# EAGLE schematic seamonster_schematic (EAGLE 8.5.2)

## Sheet 1 of 5: Power Filtering & Bypass
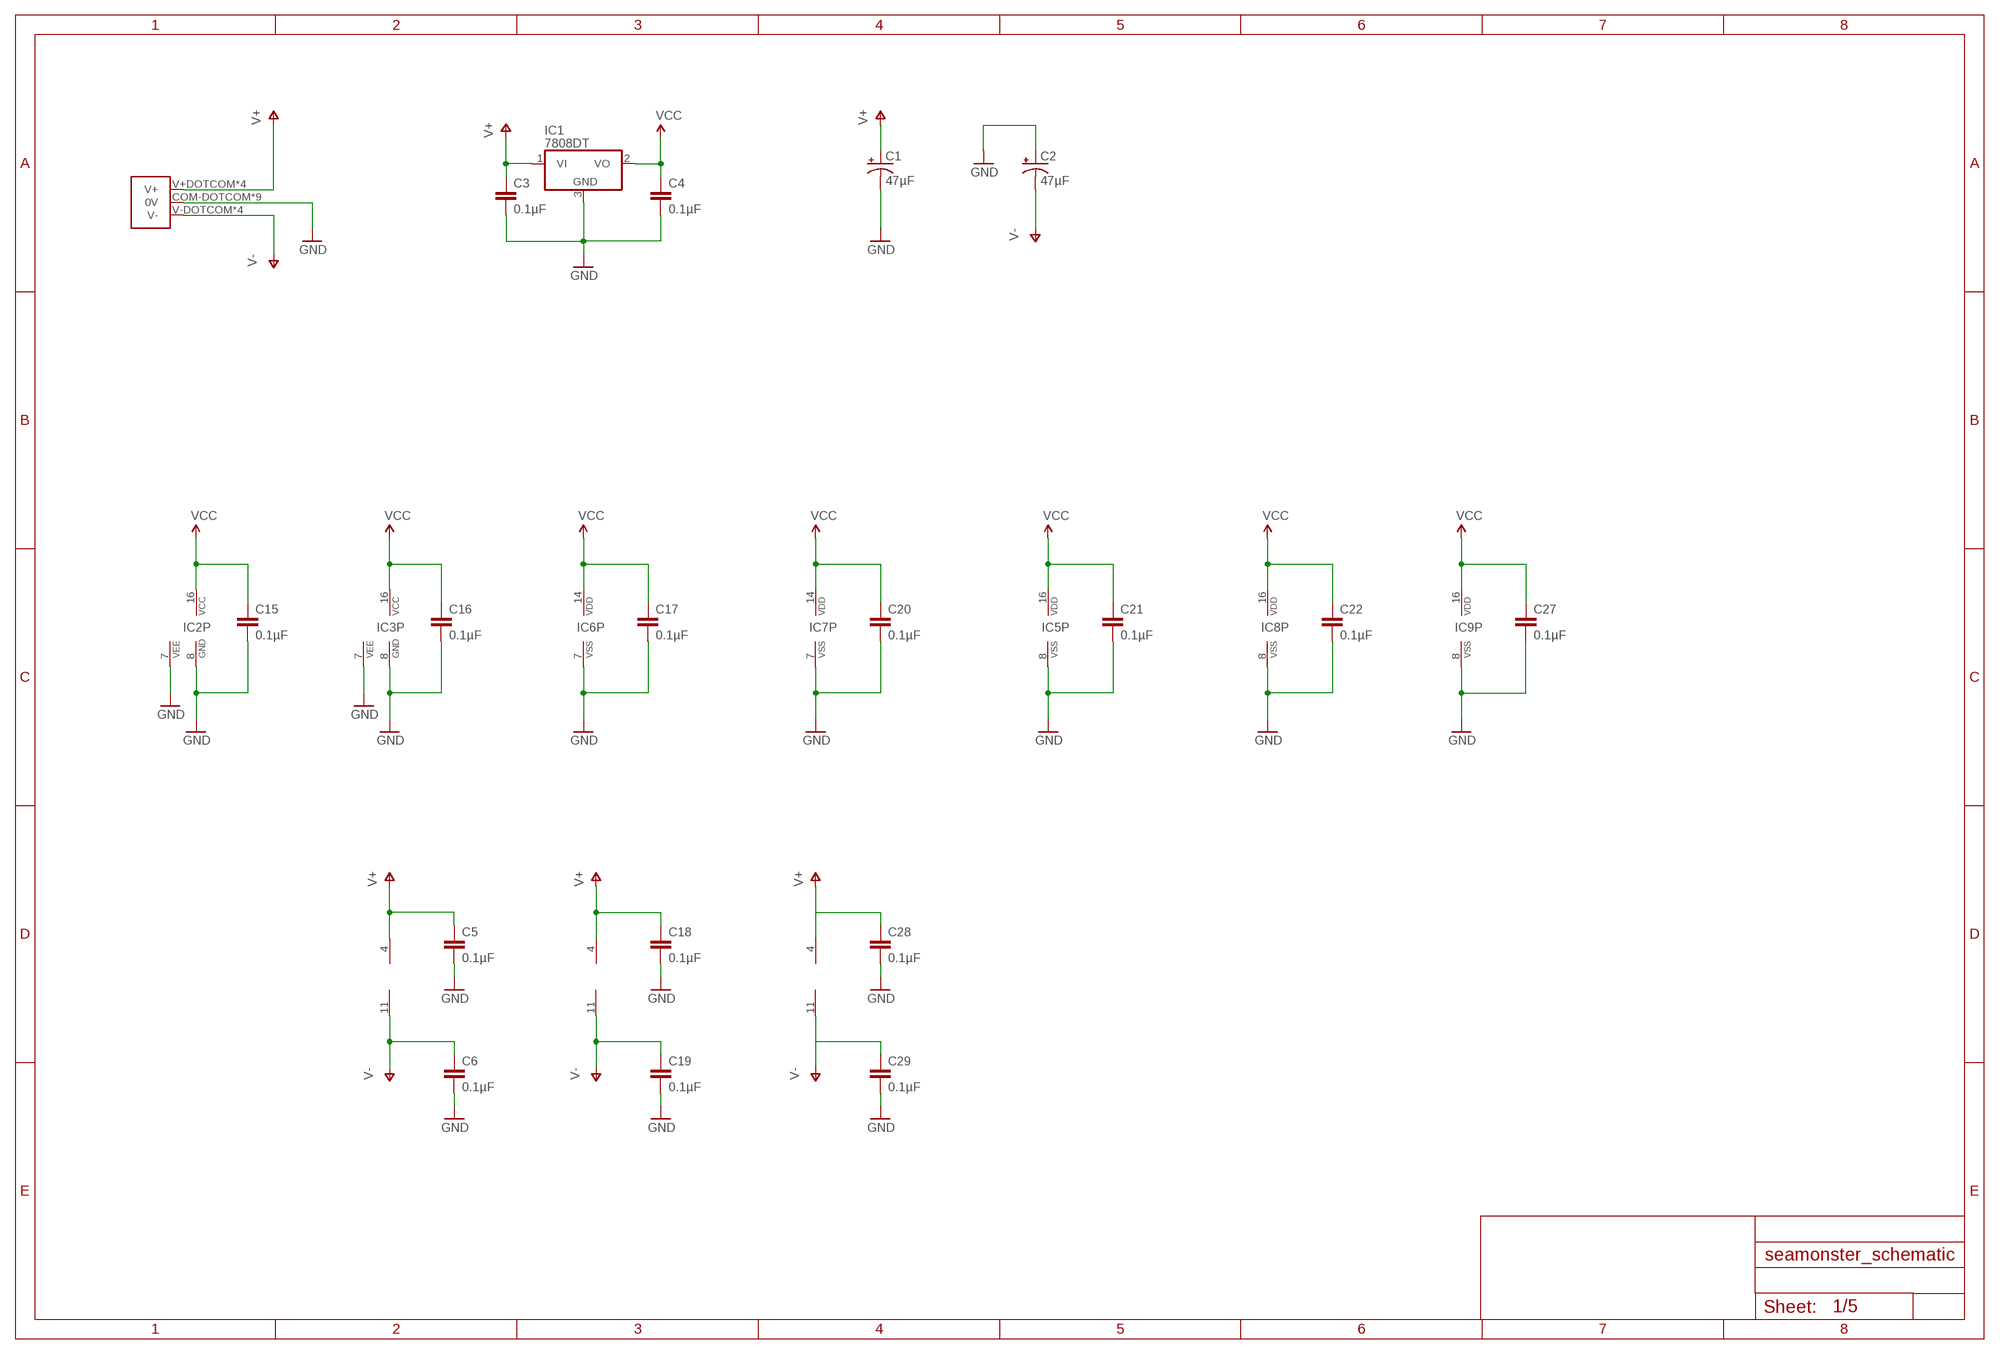
[diagram p0: schematic, sheet 1]

### Parts
C1  47µF  CAP_POLPTH2  [CPOL-RADIAL-10UF-25V]
C2  47µF  CAP_POLPTH2  [CPOL-RADIAL-10UF-25V]
C3  0.1µF  CAP0805  [0805]
C4  0.1µF  CAP0805  [0805]
C5  0.1µF  CAP0805  [0805]
C6  0.1µF  CAP0805  [0805]
C15  0.1µF  CAP0805  [0805]
C16  0.1µF  CAP0805  [0805]
C17  0.1µF  CAP0805  [0805]
C18  0.1µF  CAP0805  [0805]
C19  0.1µF  CAP0805  [0805]
C20  0.1µF  CAP0805  [0805]
C21  0.1µF  CAP0805  [0805]
C22  0.1µF  CAP0805  [0805]
C27  0.1µF  CAP0805  [0805]
C28  0.1µF  CAP0805  [0805]
C29  0.1µF  CAP0805  [0805]
IC1  7808DT  [TO252]
IC2  4051D  [SO16]
IC3  4051D  [SO16]
IC5  4046D  [SO16]
IC6  40106D  [SO14]
IC7  4070D  [SO14]
IC8  4046D  [SO16]
IC9  4040D  [SO16]
U1  TL084  TL074_SMD  [SO14]
U2  TL084  TL074_SMD  [SO14]
U3  TL084  TL074_SMD  [SO14]
U$1  COMBO_POWER  [COMBO_POWER]

### Nets
GND: C1.2(-) C2.1(+) C3.2 C4.2 C5.2 C6.2 C15.2 C16.2 C17.2 C18.2 C19.2 C20.2 C21.2 C22.2 C27.2 C28.2 C29.2 IC1.3(GND) IC2.7(VEE) IC2.8(GND) IC3.7(VEE) IC3.8(GND) IC5.8(VSS) IC6.7(P:VSS) IC7.7(P:VSS) IC8.8(VSS) IC9.8(VSS) U$1.COM-DOTCOM(0V) U$1.COM-EURO1(0V) U$1.COM-EURO2(0V) U$1.COM-EURO3(0V) U$1.COM-EURO4(0V) U$1.COM-EURO5(0V) U$1.COM-EURO6(0V) U$1.COM-MOTM1(0V) U$1.COM_MOTM2(0V) ; also sheet 2,3,4,5
V+: C1.1(+) C3.1 C5.1 C18.1 C28.1 IC1.1(VI) U1.4(P:V+) U2.4(P:V+) U3.4(P:V+) U$1.V+DOTCOM(V+) U$1.V+EURO1(V+) U$1.V+EURO2(V+) U$1.V+MOTM(V+) ; also sheet 3
V-: C2.2(-) C6.1 C19.1 C29.1 U1.11(P:V-) U2.11(P:V-) U3.11(P:V-) U$1.V-DOTCOM(V-) U$1.V-EURO1(V-) U$1.V-EURO2(V-) U$1.V-MOTM(V-) ; also sheet 3
VCC: C4.1 C15.1 C16.1 C17.1 C20.1 C21.1 C22.1 C27.1 IC1.2(VO) IC2.16(VCC) IC3.16(VCC) IC5.16(VDD) IC6.14(P:VDD) IC7.14(P:VDD) IC8.16(VDD) IC9.16(VDD) ; also sheet 3
Unconnected: IC6.12(F:O) IC6.13(F:I) U3.8(C:OUT) U3.9(C:-IN) U3.10(C:+IN) U3.12(D:+IN) U3.13(D:-IN) U3.14(D:OUT)

## Sheet 2 of 5: Clock Oscillator & Divider
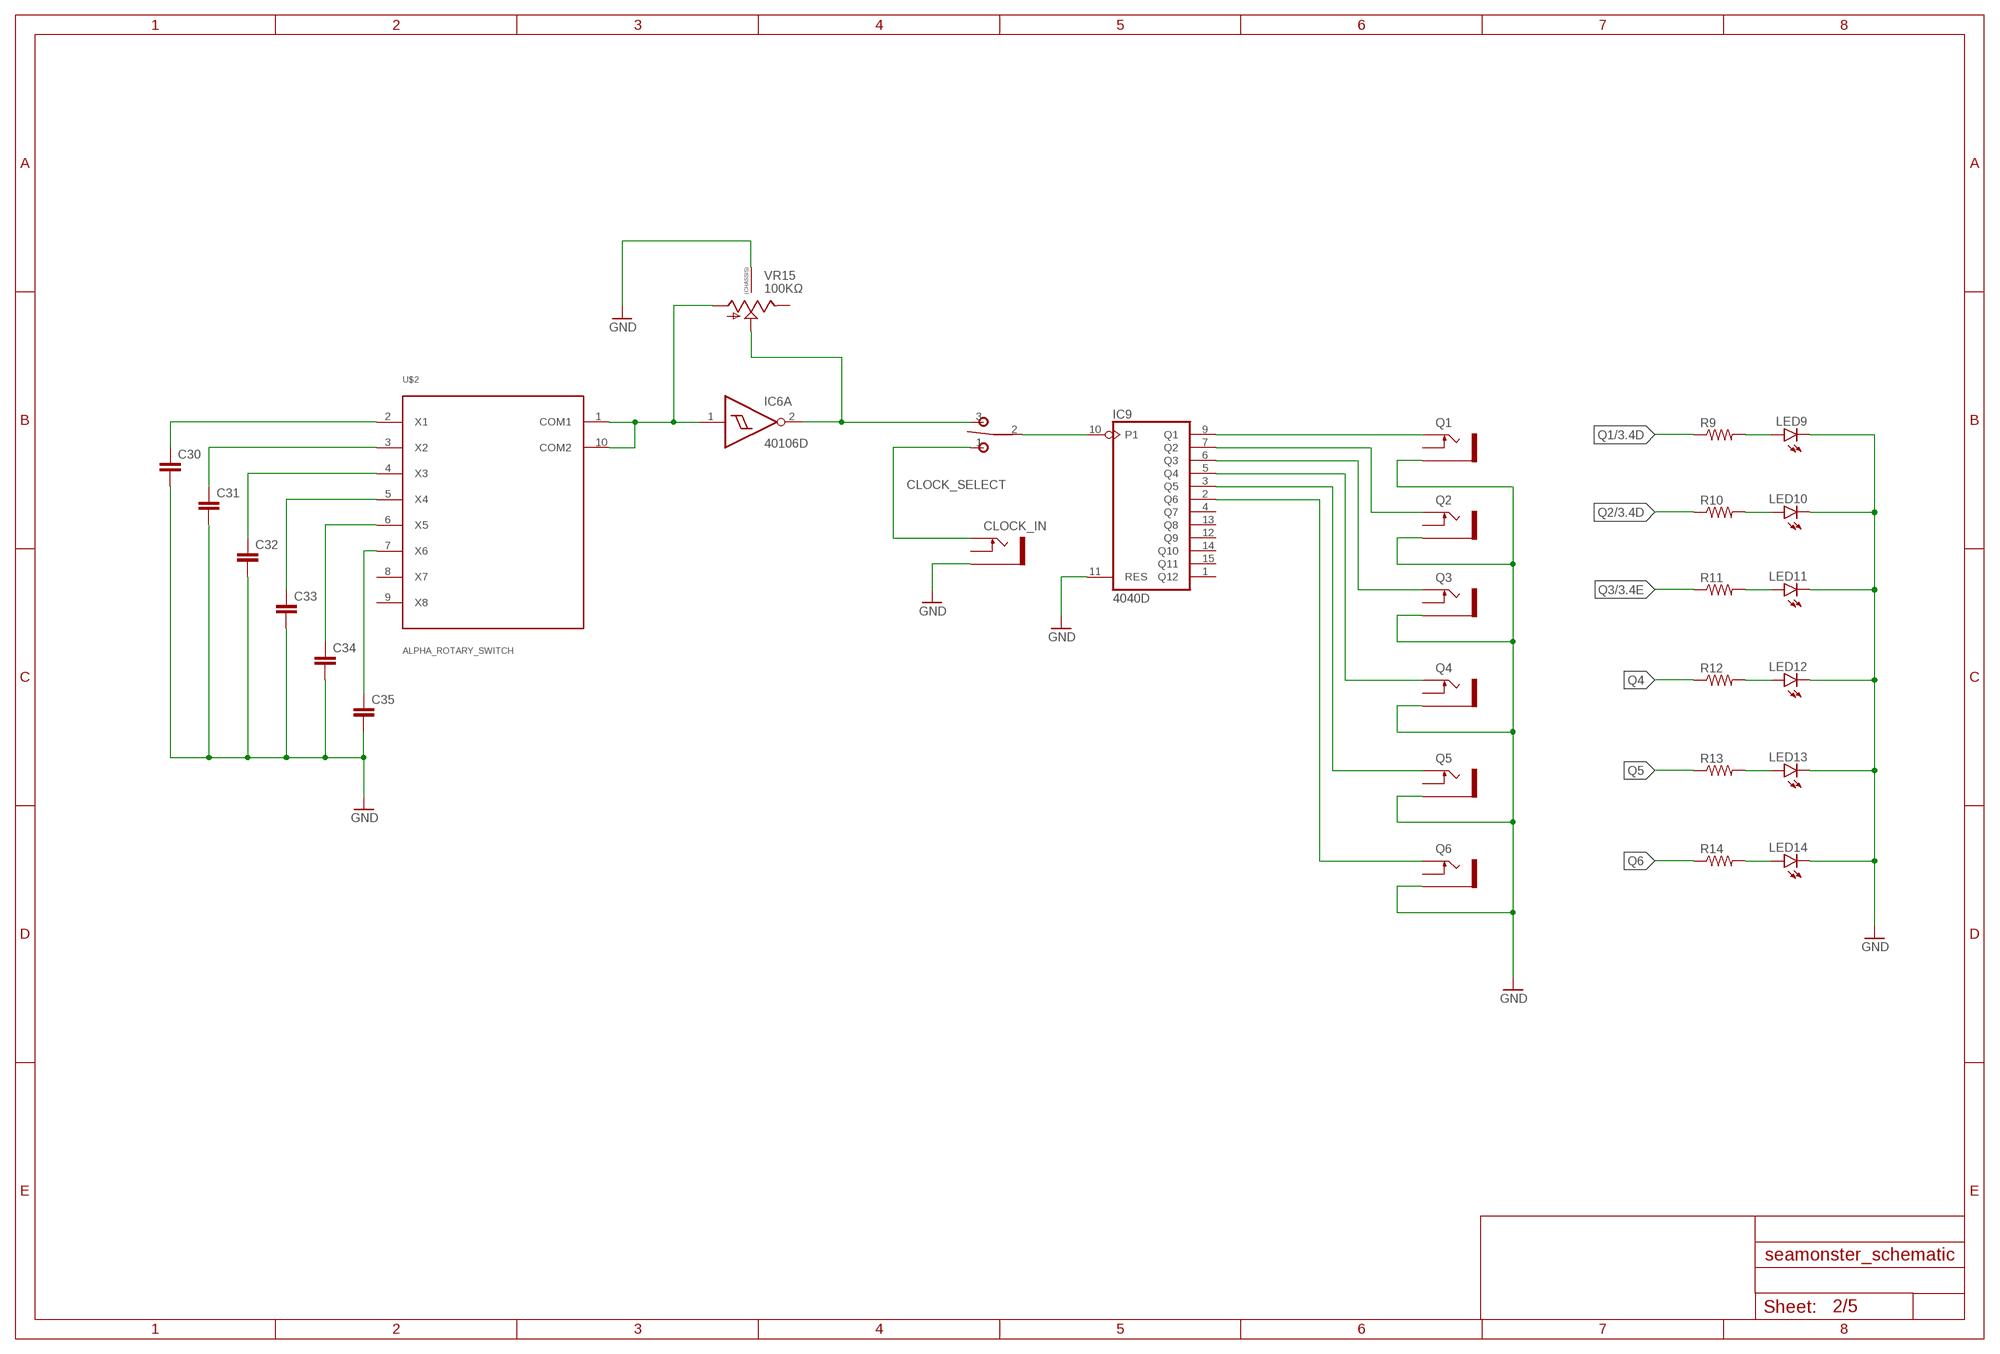
[diagram p1: schematic, sheet 2]

### Parts
C30  CAP0805  [0805]
C31  CAP0805  [0805]
C32  CAP0805  [0805]
C33  CAP0805  [0805]
C34  CAP0805  [0805]
C35  CAP0805  [0805]
CLOCK_IN  THONKICONNNEW  [WQP-PJ301M-12_JACK]
CLOCK_SELECT  SPDT ON-ON  T-80-T-SPDT-ON-OFF-ON  [M9040P]
LED9  LED3MM  [LED3MM]
LED10  LED3MM  [LED3MM]
LED11  LED3MM  [LED3MM]
LED12  LED3MM  [LED3MM]
LED13  LED3MM  [LED3MM]
LED14  LED3MM  [LED3MM]
Q1  THONKICONNNEW  [WQP-PJ301M-12_JACK]
Q2  THONKICONNNEW  [WQP-PJ301M-12_JACK]
Q3  THONKICONNNEW  [WQP-PJ301M-12_JACK]
Q4  THONKICONNNEW  [WQP-PJ301M-12_JACK]
Q5  THONKICONNNEW  [WQP-PJ301M-12_JACK]
Q6  THONKICONNNEW  [WQP-PJ301M-12_JACK]
R9  RESISTOR0805-RES  [0805]
R10  RESISTOR0805-RES  [0805]
R11  RESISTOR0805-RES  [0805]
R12  RESISTOR0805-RES  [0805]
R13  RESISTOR0805-RES  [0805]
R14  RESISTOR0805-RES  [0805]
U$2  ALPHA_ROTARY_SWITCH  [ALPHA_SR1712F]
VR15  100KΩ  9MM_SNAP-IN_POT_CHASSIS  [9MM_SNAP-IN_POT]

### Nets
GND: C30.2 C31.2 C32.2 C33.2 C34.2 C35.2 CLOCK_IN.P$3_SLEEVE(SLEEVE) IC9.11(RES) LED9.K(C) LED10.K(C) LED11.K(C) LED12.K(C) LED13.K(C) LED14.K(C) Q1.P$3_SLEEVE(SLEEVE) Q2.P$3_SLEEVE(SLEEVE) Q3.P$3_SLEEVE(SLEEVE) Q4.P$3_SLEEVE(SLEEVE) Q5.P$3_SLEEVE(SLEEVE) Q6.P$3_SLEEVE(SLEEVE) VR15.CHASSIS2 ; also sheet 1,3,4,5
N$2: IC6.1(A:I) U$2.1(COM1) U$2.10(COM2) VR15.1(A)
N$3: C30.1 U$2.2(X1)
N$4: C31.1 U$2.3(X2)
N$5: C32.1 U$2.4(X3)
N$6: C33.1 U$2.5(X4)
N$7: C34.1 U$2.6(X5)
N$8: C35.1 U$2.7(X6)
N$43: CLOCK_SELECT.3(S) IC6.2(A:O) VR15.2(S)
N$50: CLOCK_SELECT.2(P) IC9.10(P1)
N$51: LED9.A R9.2
N$65: LED10.A R10.2
N$66: LED11.A R11.2
N$67: LED12.A R12.2
N$68: LED13.A R13.2
N$69: LED14.A R14.2
N$70: CLOCK_IN.P$1_TIP(TIP) CLOCK_SELECT.1(O)
Q1: IC9.9(Q1) Q1.P$1_TIP(TIP) R9.1 ; also sheet 3
Q2: IC9.7(Q2) Q2.P$1_TIP(TIP) R10.1 ; also sheet 3
Q3: IC9.6(Q3) Q3.P$1_TIP(TIP) R11.1 ; also sheet 3
Q4: IC9.5(Q4) Q4.P$1_TIP(TIP) R12.1
Q5: IC9.3(Q5) Q5.P$1_TIP(TIP) R13.1
Q6: IC9.2(Q6) Q6.P$1_TIP(TIP) R14.1
Unconnected: CLOCK_IN.P$2_SWITCH(SWITCH) IC9.1(Q12) IC9.4(Q7) IC9.12(Q9) IC9.13(Q8) IC9.14(Q10) IC9.15(Q11) Q1.P$2_SWITCH(SWITCH) Q2.P$2_SWITCH(SWITCH) Q3.P$2_SWITCH(SWITCH) Q4.P$2_SWITCH(SWITCH) Q5.P$2_SWITCH(SWITCH) Q6.P$2_SWITCH(SWITCH) U$2.8(X7) U$2.9(X8) VR15.3(E)

## Sheet 3 of 5: Multiplexing
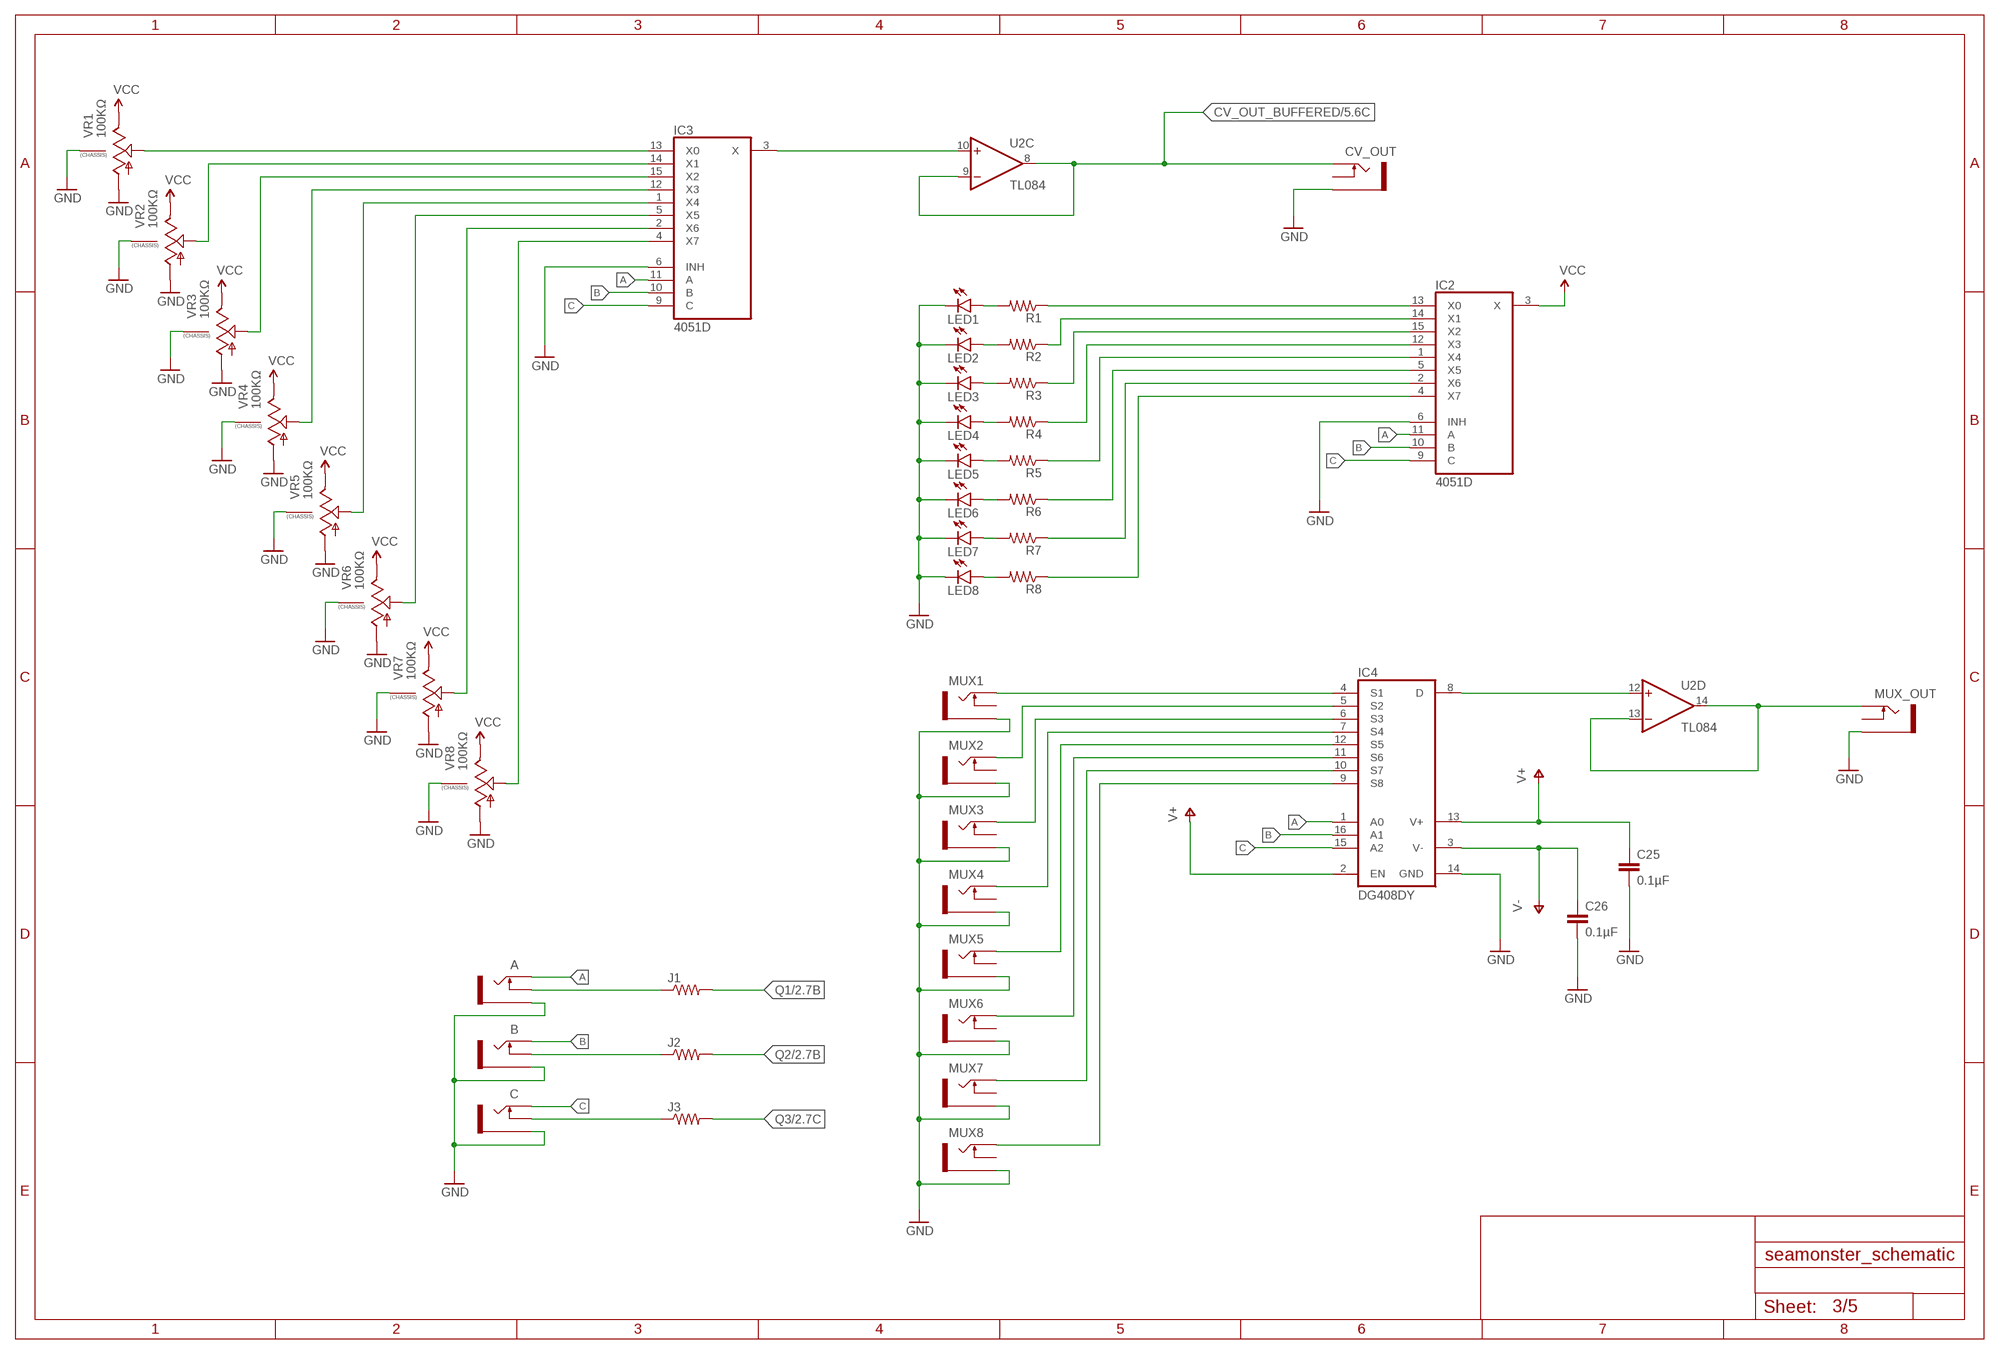
[diagram p2: schematic, sheet 3]

### Parts
A  THONKICONNNEW  [WQP-PJ301M-12_JACK]
B  THONKICONNNEW  [WQP-PJ301M-12_JACK]
C  THONKICONNNEW  [WQP-PJ301M-12_JACK]
C25  0.1µF  CAP0805  [0805]
C26  0.1µF  CAP0805  [0805]
CV_OUT  THONKICONNNEW  [WQP-PJ301M-12_JACK]
IC4  DG408DY  [SO16]
J1  RESISTOR0805-RES  [0805]
J2  RESISTOR0805-RES  [0805]
J3  RESISTOR0805-RES  [0805]
LED1  LED3MM  [LED3MM]
LED2  LED3MM  [LED3MM]
LED3  LED3MM  [LED3MM]
LED4  LED3MM  [LED3MM]
LED5  LED3MM  [LED3MM]
LED6  LED3MM  [LED3MM]
LED7  LED3MM  [LED3MM]
LED8  LED3MM  [LED3MM]
MUX1  THONKICONNNEW  [WQP-PJ301M-12_JACK]
MUX2  THONKICONNNEW  [WQP-PJ301M-12_JACK]
MUX3  THONKICONNNEW  [WQP-PJ301M-12_JACK]
MUX4  THONKICONNNEW  [WQP-PJ301M-12_JACK]
MUX5  THONKICONNNEW  [WQP-PJ301M-12_JACK]
MUX6  THONKICONNNEW  [WQP-PJ301M-12_JACK]
MUX7  THONKICONNNEW  [WQP-PJ301M-12_JACK]
MUX8  THONKICONNNEW  [WQP-PJ301M-12_JACK]
MUX_OUT  THONKICONNNEW  [WQP-PJ301M-12_JACK]
R1  RESISTOR0805-RES  [0805]
R2  RESISTOR0805-RES  [0805]
R3  RESISTOR0805-RES  [0805]
R4  RESISTOR0805-RES  [0805]
R5  RESISTOR0805-RES  [0805]
R6  RESISTOR0805-RES  [0805]
R7  RESISTOR0805-RES  [0805]
R8  RESISTOR0805-RES  [0805]
VR1  100KΩ  9MM_SNAP-IN_POT_CHASSIS  [9MM_SNAP-IN_POT]
VR2  100KΩ  9MM_SNAP-IN_POT_CHASSIS  [9MM_SNAP-IN_POT]
VR3  100KΩ  9MM_SNAP-IN_POT_CHASSIS  [9MM_SNAP-IN_POT]
VR4  100KΩ  9MM_SNAP-IN_POT_CHASSIS  [9MM_SNAP-IN_POT]
VR5  100KΩ  9MM_SNAP-IN_POT_CHASSIS  [9MM_SNAP-IN_POT]
VR6  100KΩ  9MM_SNAP-IN_POT_CHASSIS  [9MM_SNAP-IN_POT]
VR7  100KΩ  9MM_SNAP-IN_POT_CHASSIS  [9MM_SNAP-IN_POT]
VR8  100KΩ  9MM_SNAP-IN_POT_CHASSIS  [9MM_SNAP-IN_POT]

### Nets
A: A.P$1_TIP(TIP) IC2.11(A) IC3.11(A) IC4.1(A0)
B: B.P$1_TIP(TIP) IC2.10(B) IC3.10(B) IC4.16(A1)
C: C.P$1_TIP(TIP) IC2.9(C) IC3.9(C) IC4.15(A2)
CV_OUT: IC3.3(X) U2.10(C:+IN)
CV_OUT_BUFFERED: CV_OUT.P$1_TIP(TIP) U2.8(C:OUT) U2.9(C:-IN) ; also sheet 5
GND: A.P$3_SLEEVE(SLEEVE) B.P$3_SLEEVE(SLEEVE) C25.2 C26.2 C.P$3_SLEEVE(SLEEVE) CV_OUT.P$3_SLEEVE(SLEEVE) IC2.6(INH) IC3.6(INH) IC4.14(GND) LED1.K(C) LED2.K(C) LED3.K(C) LED4.K(C) LED5.K(C) LED6.K(C) LED7.K(C) LED8.K(C) MUX1.P$3_SLEEVE(SLEEVE) MUX2.P$3_SLEEVE(SLEEVE) MUX3.P$3_SLEEVE(SLEEVE) MUX4.P$3_SLEEVE(SLEEVE) MUX5.P$3_SLEEVE(SLEEVE) MUX6.P$3_SLEEVE(SLEEVE) MUX7.P$3_SLEEVE(SLEEVE) MUX8.P$3_SLEEVE(SLEEVE) MUX_OUT.P$3_SLEEVE(SLEEVE) VR1.1(A) VR1.CHASSIS2 VR2.1(A) VR2.CHASSIS2 VR3.1(A) VR3.CHASSIS2 VR4.1(A) VR4.CHASSIS2 VR5.1(A) VR5.CHASSIS2 VR6.1(A) VR6.CHASSIS2 VR7.1(A) VR7.CHASSIS2 VR8.1(A) VR8.CHASSIS2 ; also sheet 1,2,4,5
MUX1: IC4.4(S1) MUX1.P$1_TIP(TIP)
MUX2: IC4.5(S2) MUX2.P$1_TIP(TIP)
MUX3: IC4.6(S3) MUX3.P$1_TIP(TIP)
MUX4: IC4.7(S4) MUX4.P$1_TIP(TIP)
MUX5: IC4.12(S5) MUX5.P$1_TIP(TIP)
MUX6: IC4.11(S6) MUX6.P$1_TIP(TIP)
MUX7: IC4.10(S7) MUX7.P$1_TIP(TIP)
MUX8: IC4.9(S8) MUX8.P$1_TIP(TIP)
N$1: IC4.8(D) U2.12(D:+IN)
N$9: MUX_OUT.P$1_TIP(TIP) U2.13(D:-IN) U2.14(D:OUT)
N$10: LED1.A R1.2
N$11: LED2.A R2.2
N$12: LED3.A R3.2
N$13: LED4.A R4.2
N$14: LED5.A R5.2
N$15: LED6.A R6.2
N$16: LED7.A R7.2
N$17: LED8.A R8.2
N$18: IC3.13(X0) VR1.2(S)
N$19: IC2.13(X0) R1.1
N$20: IC2.14(X1) R2.1
N$21: IC2.15(X2) R3.1
N$22: IC2.12(X3) R4.1
N$23: IC2.1(X4) R5.1
N$24: IC2.5(X5) R6.1
N$25: IC2.2(X6) R7.1
N$26: IC2.4(X7) R8.1
N$27: IC3.14(X1) VR2.2(S)
N$28: IC3.15(X2) VR3.2(S)
N$29: IC3.12(X3) VR4.2(S)
N$30: IC3.1(X4) VR5.2(S)
N$31: IC3.5(X5) VR6.2(S)
N$32: IC3.2(X6) VR7.2(S)
N$33: IC3.4(X7) VR8.2(S)
N$34: A.P$2_SWITCH(SWITCH) J1.1
N$37: B.P$2_SWITCH(SWITCH) J2.1
N$76: C.P$2_SWITCH(SWITCH) J3.1
Q1: J1.2 ; also sheet 2
Q2: J2.2 ; also sheet 2
Q3: J3.2 ; also sheet 2
V+: C25.1 IC4.2(EN) IC4.13(V+) ; also sheet 1
V-: C26.1 IC4.3(V-) ; also sheet 1
VCC: IC2.3(X) VR1.3(E) VR2.3(E) VR3.3(E) VR4.3(E) VR5.3(E) VR6.3(E) VR7.3(E) VR8.3(E) ; also sheet 1
Unconnected: CV_OUT.P$2_SWITCH(SWITCH) MUX1.P$2_SWITCH(SWITCH) MUX2.P$2_SWITCH(SWITCH) MUX3.P$2_SWITCH(SWITCH) MUX4.P$2_SWITCH(SWITCH) MUX5.P$2_SWITCH(SWITCH) MUX6.P$2_SWITCH(SWITCH) MUX7.P$2_SWITCH(SWITCH) MUX8.P$2_SWITCH(SWITCH) MUX_OUT.P$2_SWITCH(SWITCH)

## Sheet 4 of 5: Fixed Frequency Oscillators
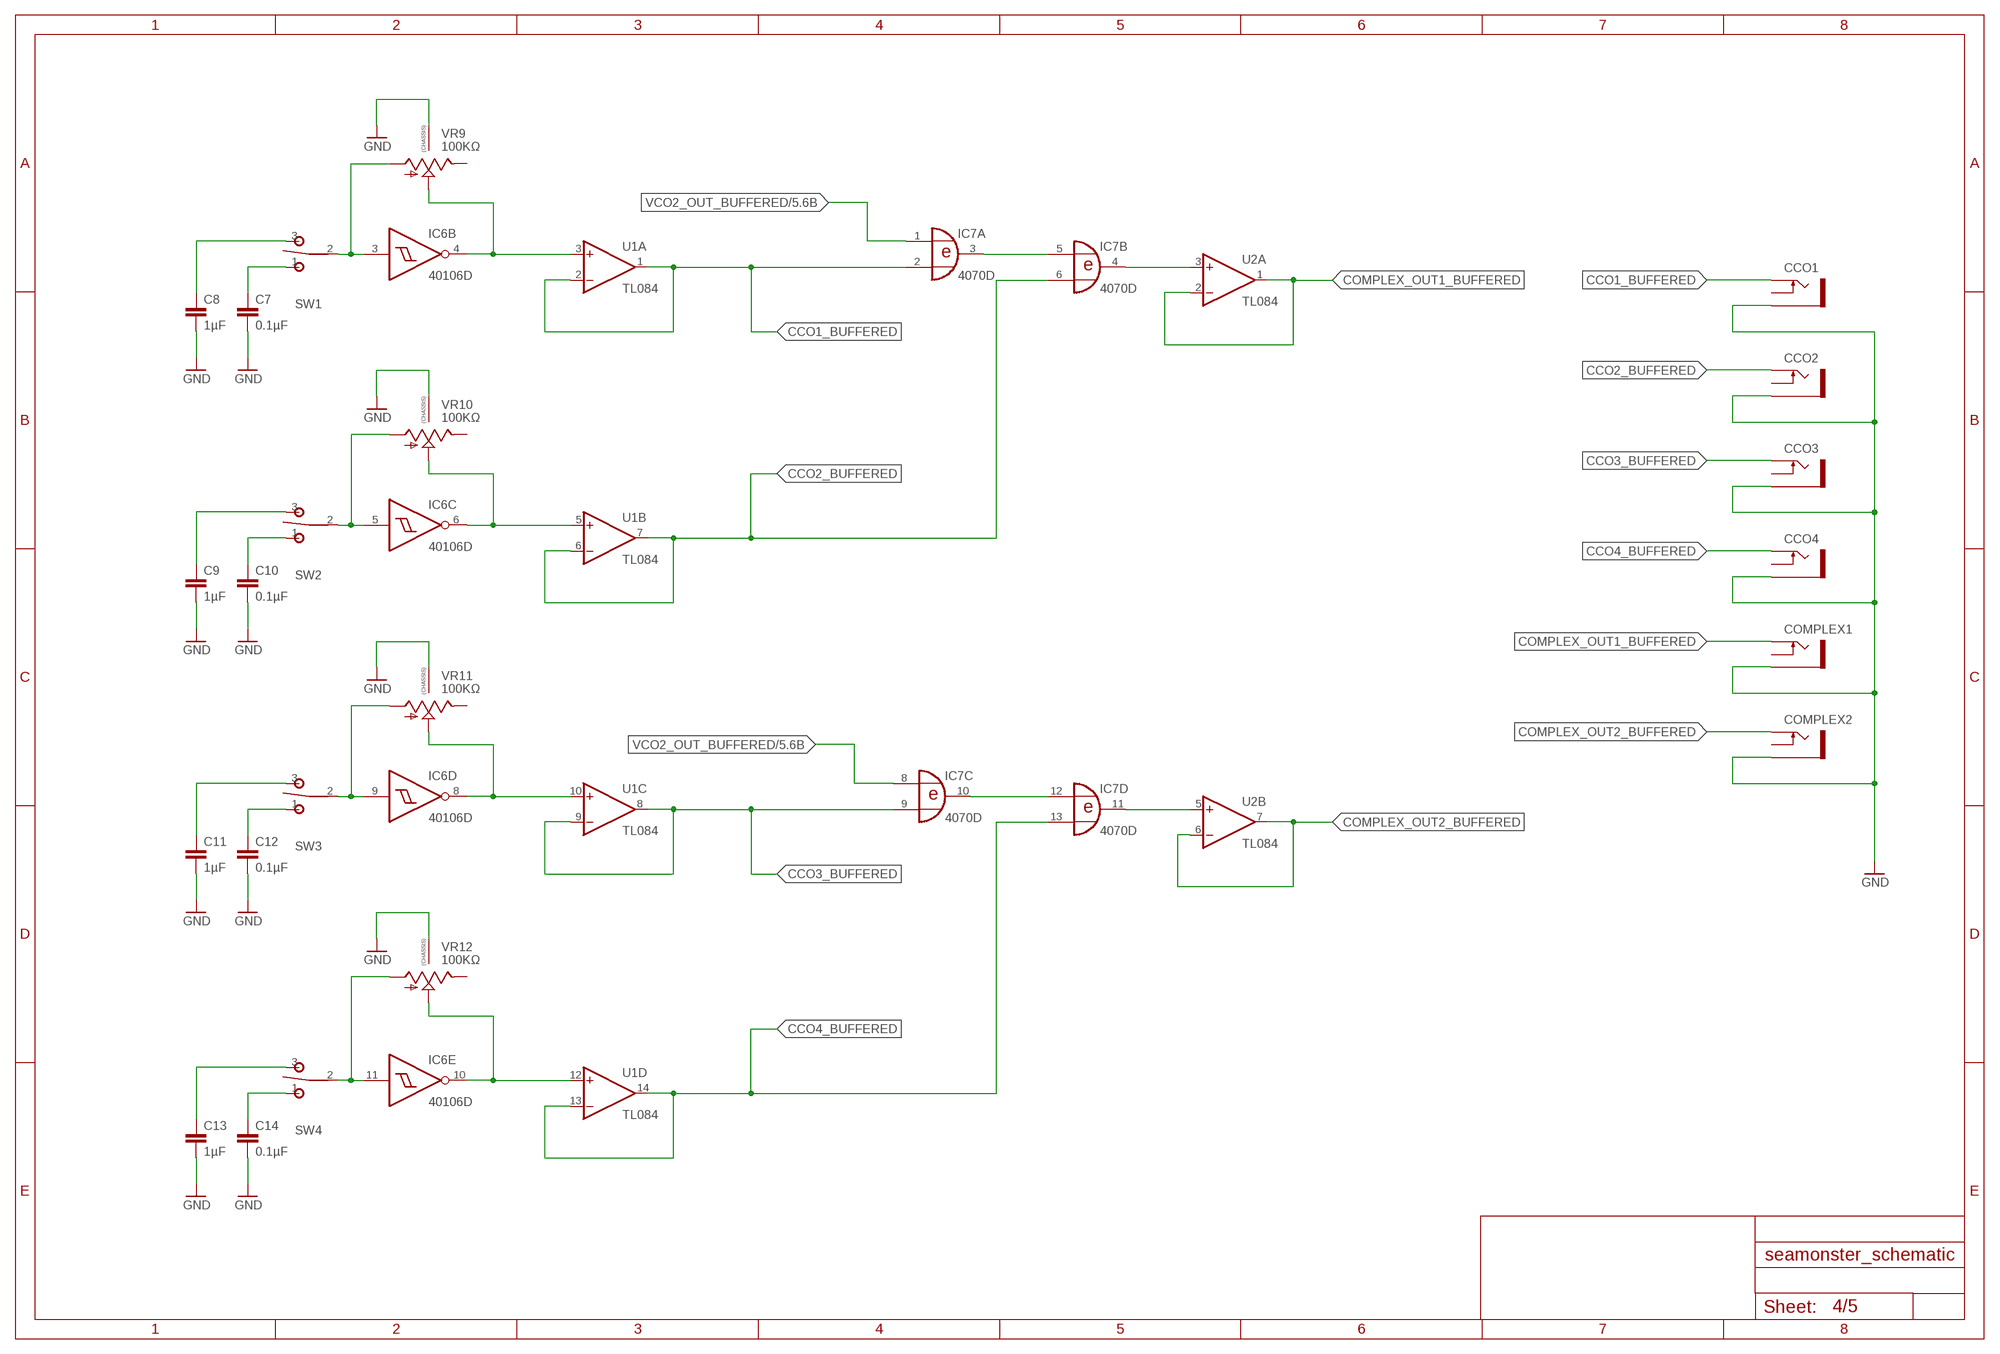
[diagram p3: schematic, sheet 4]

### Parts
C7  0.1µF  CAP0805  [0805]
C8  1µF  CAP0805  [0805]
C9  1µF  CAP0805  [0805]
C10  0.1µF  CAP0805  [0805]
C11  1µF  CAP0805  [0805]
C12  0.1µF  CAP0805  [0805]
C13  1µF  CAP0805  [0805]
C14  0.1µF  CAP0805  [0805]
CCO1  THONKICONNNEW  [WQP-PJ301M-12_JACK]
CCO2  THONKICONNNEW  [WQP-PJ301M-12_JACK]
CCO3  THONKICONNNEW  [WQP-PJ301M-12_JACK]
CCO4  THONKICONNNEW  [WQP-PJ301M-12_JACK]
COMPLEX1  THONKICONNNEW  [WQP-PJ301M-12_JACK]
COMPLEX2  THONKICONNNEW  [WQP-PJ301M-12_JACK]
SW1  SPDT ON-ON  T-80-T-SPDT-ON-OFF-ON  [M9040P]
SW2  SPDT ON-ON  T-80-T-SPDT-ON-OFF-ON  [M9040P]
SW3  SPDT ON-ON  T-80-T-SPDT-ON-OFF-ON  [M9040P]
SW4  SPDT ON-ON  T-80-T-SPDT-ON-OFF-ON  [M9040P]
VR9  100KΩ  9MM_SNAP-IN_POT_CHASSIS  [9MM_SNAP-IN_POT]
VR10  100KΩ  9MM_SNAP-IN_POT_CHASSIS  [9MM_SNAP-IN_POT]
VR11  100KΩ  9MM_SNAP-IN_POT_CHASSIS  [9MM_SNAP-IN_POT]
VR12  100KΩ  9MM_SNAP-IN_POT_CHASSIS  [9MM_SNAP-IN_POT]

### Nets
CCO1_BUFFERED: CCO1.P$1_TIP(TIP) IC7.2(A:I1) U1.1(A:OUT) U1.2(A:-IN)
CCO2_BUFFERED: CCO2.P$1_TIP(TIP) IC7.6(B:I1) U1.6(B:-IN) U1.7(B:OUT)
CCO3_BUFFERED: CCO3.P$1_TIP(TIP) IC7.9(C:I1) U1.8(C:OUT) U1.9(C:-IN)
CCO4_BUFFERED: CCO4.P$1_TIP(TIP) IC7.13(D:I1) U1.13(D:-IN) U1.14(D:OUT)
COMPLEX_OUT1_BUFFERED: COMPLEX1.P$1_TIP(TIP) U2.1(A:OUT) U2.2(A:-IN)
COMPLEX_OUT2_BUFFERED: COMPLEX2.P$1_TIP(TIP) U2.6(B:-IN) U2.7(B:OUT)
GND: C7.2 C8.2 C9.2 C10.2 C11.2 C12.2 C13.2 C14.2 VR9.CHASSIS2 VR10.CHASSIS2 VR11.CHASSIS2 VR12.CHASSIS2 ; also sheet 1,2,3,5
INV_B_IN: IC6.3(B:I) SW1.2(P) VR9.1(A)
INV_B_OUT: IC6.4(B:O) U1.3(A:+IN) VR9.2(S)
INV_C_IN: IC6.5(C:I) SW2.2(P) VR10.1(A)
INV_C_OUT: IC6.6(C:O) U1.5(B:+IN) VR10.2(S)
INV_D_IN: IC6.9(D:I) SW3.2(P) VR11.1(A)
INV_D_OUT: IC6.8(D:O) U1.10(C:+IN) VR11.2(S)
INV_E_IN: IC6.11(E:I) SW4.2(P) VR12.1(A)
INV_E_OUT: IC6.10(E:O) U1.12(D:+IN) VR12.2(S)
N$35: IC7.3(A:O) IC7.5(B:I0)
N$36: IC7.10(C:O) IC7.12(D:I0)
N$38: IC7.4(B:O) U2.3(A:+IN)
N$39: IC7.11(D:O) U2.5(B:+IN)
N$47: C7.1 SW1.1(O)
N$52: C8.1 SW1.3(S)
N$55: C10.1 SW2.1(O)
N$56: C9.1 SW2.3(S)
N$59: C12.1 SW3.1(O)
N$60: C11.1 SW3.3(S)
N$63: C14.1 SW4.1(O)
N$64: C13.1 SW4.3(S)
N$73: CCO1.P$3_SLEEVE(SLEEVE) CCO2.P$3_SLEEVE(SLEEVE) CCO3.P$3_SLEEVE(SLEEVE) CCO4.P$3_SLEEVE(SLEEVE) COMPLEX1.P$3_SLEEVE(SLEEVE) COMPLEX2.P$3_SLEEVE(SLEEVE) ; supply symbol labelled GND
VCO2_OUT_BUFFERED: IC7.1(A:I0) IC7.8(C:I0) ; also sheet 5
Unconnected: CCO1.P$2_SWITCH(SWITCH) CCO2.P$2_SWITCH(SWITCH) CCO3.P$2_SWITCH(SWITCH) CCO4.P$2_SWITCH(SWITCH) COMPLEX1.P$2_SWITCH(SWITCH) COMPLEX2.P$2_SWITCH(SWITCH) VR9.3(E) VR10.3(E) VR11.3(E) VR12.3(E)

## Sheet 5 of 5: Voltage Controlled Oscillators
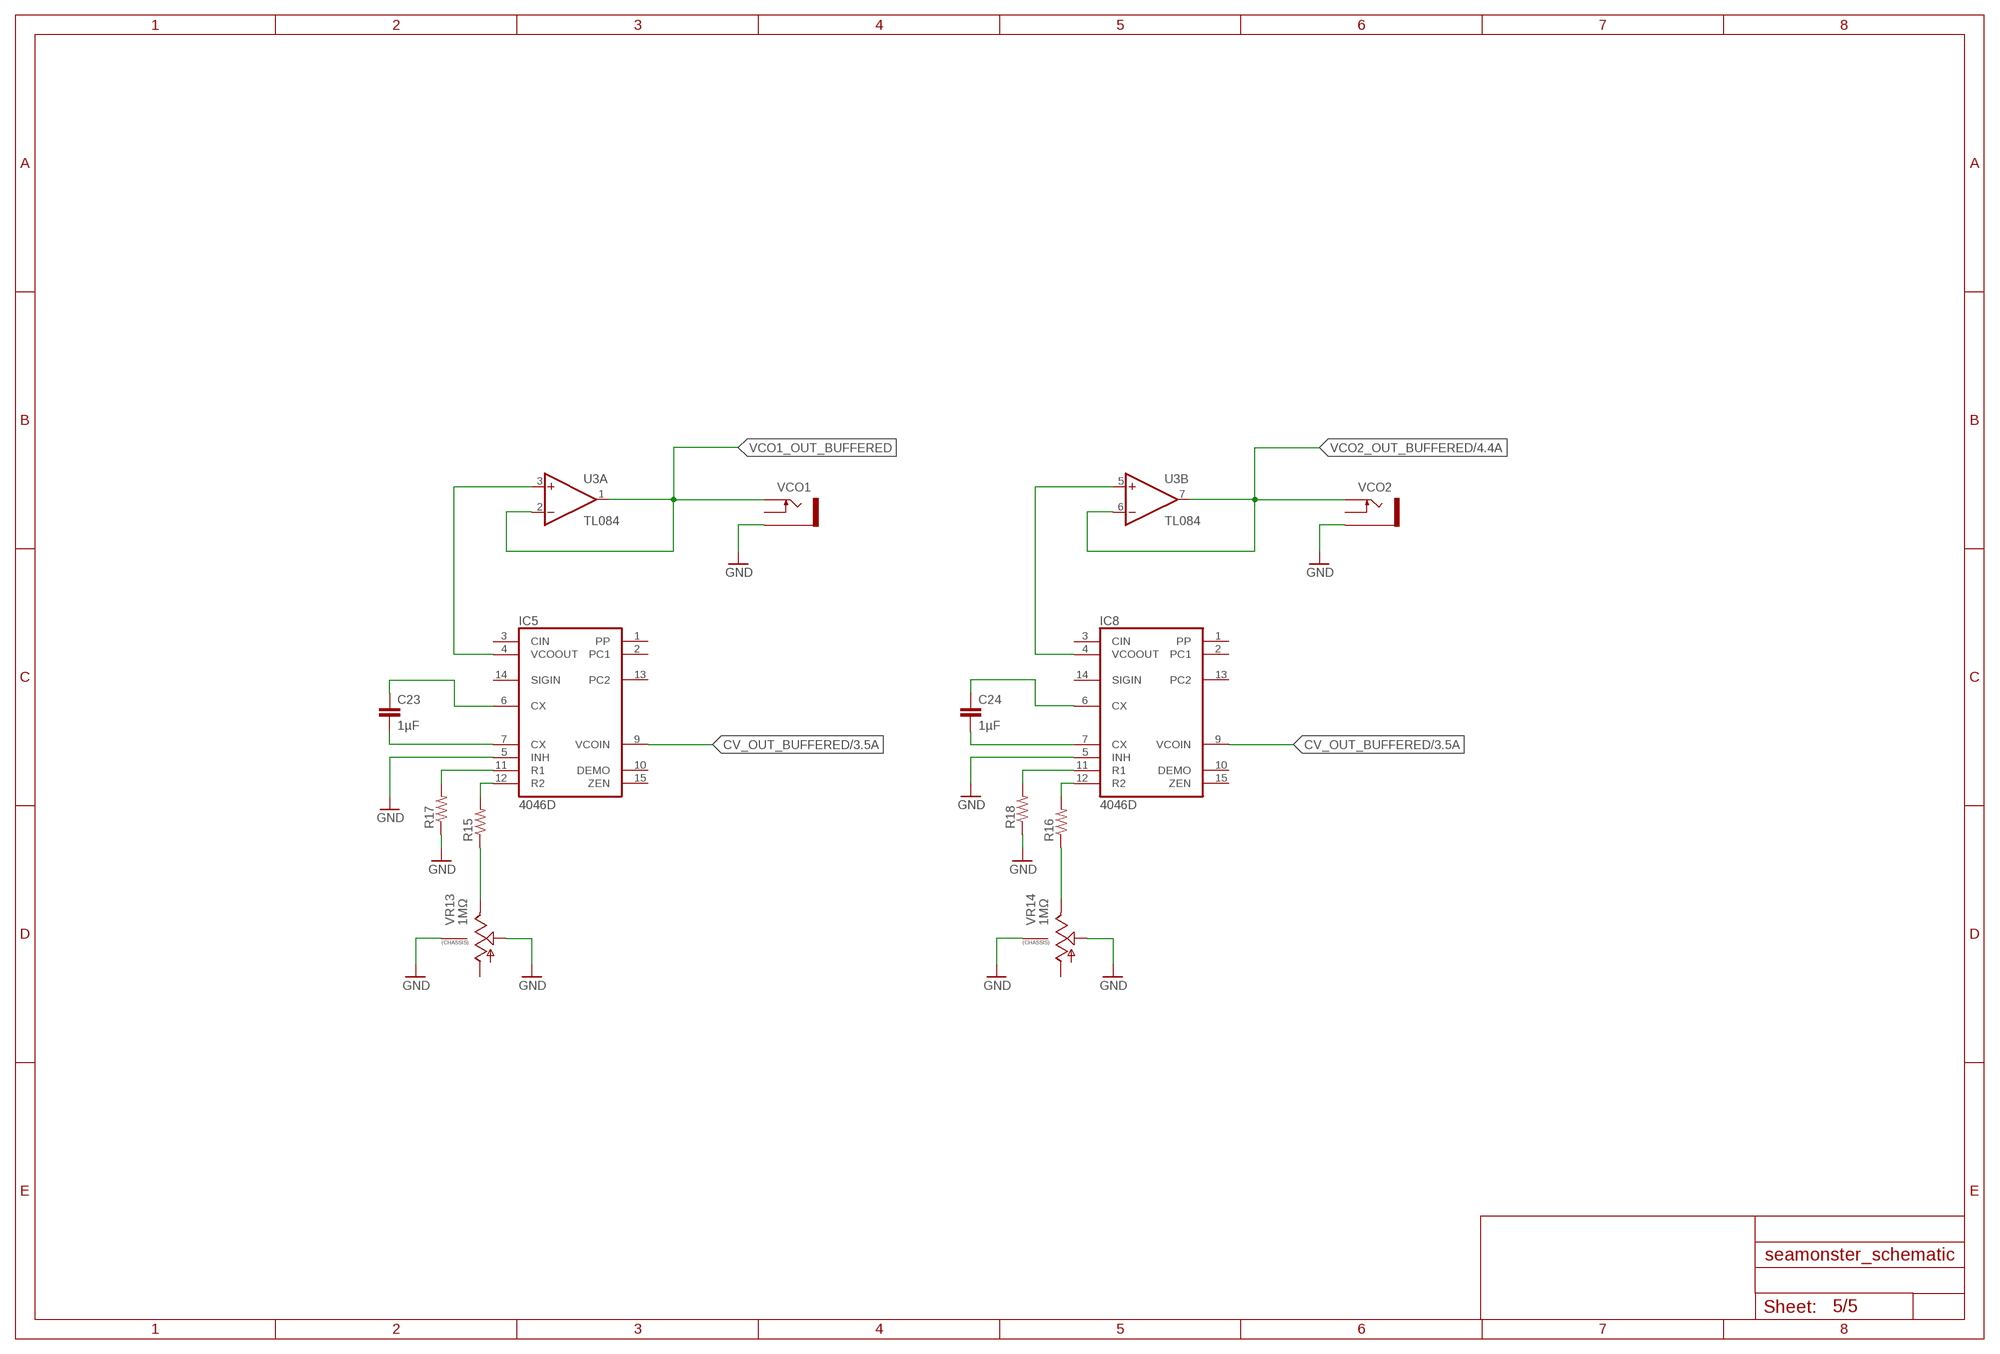
[diagram p4: schematic, sheet 5]

### Parts
C23  1µF  CAP0805  [0805]
C24  1µF  CAP0805  [0805]
R15  RESISTOR0805-RES  [0805]
R16  RESISTOR0805-RES  [0805]
R17  RESISTOR0805-RES  [0805]
R18  RESISTOR0805-RES  [0805]
VCO1  THONKICONNNEW  [WQP-PJ301M-12_JACK]
VCO2  THONKICONNNEW  [WQP-PJ301M-12_JACK]
VR13  1MΩ  9MM_SNAP-IN_POT_CHASSIS  [9MM_SNAP-IN_POT]
VR14  1MΩ  9MM_SNAP-IN_POT_CHASSIS  [9MM_SNAP-IN_POT]

### Nets
CV_OUT_BUFFERED: IC5.9(VCOIN) IC8.9(VCOIN) ; also sheet 3
GND: IC5.5(INH) IC8.5(INH) R17.1 R18.1 VCO1.P$3_SLEEVE(SLEEVE) VCO2.P$3_SLEEVE(SLEEVE) VR13.2(S) VR13.CHASSIS2 VR14.2(S) VR14.CHASSIS2 ; also sheet 1,2,3,4
N$40: IC5.12(R2) R15.2
N$42: R15.1 VR13.3(E)
N$44: C23.1 IC5.6(CX)
N$45: C23.2 IC5.7(CX)
N$48: C24.1 IC8.6(CX)
N$49: C24.2 IC8.7(CX)
N$71: IC8.12(R2) R16.2
N$72: R16.1 VR14.3(E)
N$74: IC8.11(R1) R18.2
N$75: IC5.11(R1) R17.2
VCO1_OUT: IC5.4(VCOOUT) U3.3(A:+IN)
VCO1_OUT_BUFFERED: U3.1(A:OUT) U3.2(A:-IN) VCO1.P$1_TIP(TIP)
VCO2_OUT: IC8.4(VCOOUT) U3.5(B:+IN)
VCO2_OUT_BUFFERED: U3.6(B:-IN) U3.7(B:OUT) VCO2.P$1_TIP(TIP) ; also sheet 4
Unconnected: IC5.1(PP) IC5.2(PC1) IC5.3(CIN) IC5.10(DEMO) IC5.13(PC2) IC5.14(SIGIN) IC5.15(ZEN) IC8.1(PP) IC8.2(PC1) IC8.3(CIN) IC8.10(DEMO) IC8.13(PC2) IC8.14(SIGIN) IC8.15(ZEN) VCO1.P$2_SWITCH(SWITCH) VCO2.P$2_SWITCH(SWITCH) VR13.1(A) VR14.1(A)

## Library data of the parts
A B C CCO1-CCO4 CLOCK_IN COMPLEX1 COMPLEX2 CV_OUT MUX1-MUX8 MUX_OUT Q1-Q6 VCO1 VCO2 = MusicThingModular:THONKICONN: 3.5mm socket for Eurorack modular synths
C1 C2 = SparkFun-Capacitors:CAP_POL: Capacitor Polarized These are standard SMD and PTH capacitors. Normally 10uF, 47uF, and 100uF in electrolytic and tantalum varieties. Always verify the external diameter of the through hole cap, it varies with capacity, voltage, and manufacturer. The EIA devices should be standard.
C3-C35 = SparkFun-Capacitors:CAP: Capacitor Standard 0603 ceramic capacitor, and 0.1" leaded capacitor.
CLOCK_SELECT SW1-SW4 = MusicThingModular:T-80-T-SPDT-ON-OFF-ON
IC1 = linear:78*: Positive VOLTAGE REGULATOR Source: http://cache.national.com/ds/LM/LM78L05.pdf http://www.fairchildsemi.com/ds/LM/LM7805.pdf
IC2 IC3 = 40xx:4051: 8-channel ANALOG MULTIPLEXER
IC4 = maxim:DG408DY: ANALOG MULTIPLEXER; MPN: DG408DY+T; OC_FARNELL: 1077070; OC_NEWARK: 67K3719
IC5 IC8 = 40xx:4046: Micropower PLL
IC6 = 40xx:40106: Hex SCHMITT TRIGGER
IC7 = 40xx:4070: Quad 2-input XOR
IC9 = 40xx:4040: 12-stage binary/ripple COUNTER
J1-J3 R1-R18 = SparkFun-Resistors:RESISTOR: Resistor Basic schematic elements and footprints for 0603, 1206, and PTH resistors.
LED1-LED14 = SparkFun-LED:LED: LEDs Standard schematic elements and footprints for 5mm, 3mm, 1206, and 0603 sized LEDs. 5mm - Spark Fun Electronics SKU : COM-00529 (and others)
U1-U3 = MusicThingModular:TL074: Generic Quad Op Amp
U$1 = combo_power:COMBO_POWER
U$2 = alpha_8pos_rotary_switch:ALPHA_ROTARY_SWITCH
VR1-VR15 = MusicThingModular:9MM_SNAP-IN_POT_CHASSIS: 9mm vertical snap-in pot, Alpha / Panasonic style, with a connection to the metal chassis for grounding